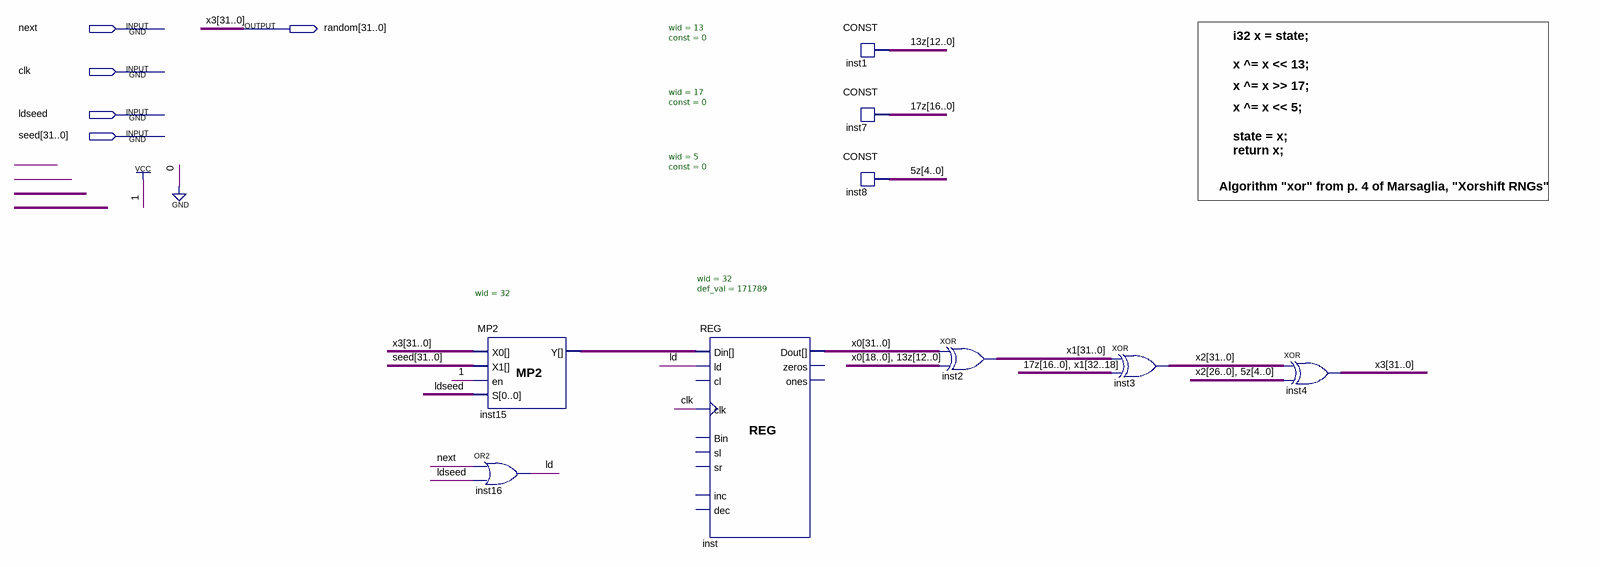
[diagram p0: schematic sheet]
// Quartus schematic random.bdf as structural Verilog: 9 symbols, 5 pins
module random (
  input  next,
  input  clk,
  input  ldseed,
  input  [31:0] seed,
  output [31:0] random
);

  wire ld;
  wire [4:0] \5z ;
  wire [12:0] \13z ;
  wire [16:0] \17z ;
  wire [31:0] inst15_y, x0, x2;
  wire [32:0] x1;

  MP2 #(.wid(32)) inst15 (.X0(random), .X1(seed), .en(1'b1), .S(ldseed), .Y(inst15_y));
  or inst16 (ld, next, ldseed);
  REG #(.wid(32), .def_val(171789)) inst (
    .ld(ld), .clk(clk), .Din(inst15_y), .Dout(x0));  // open: cl, Bin, sl, sr, inc, dec, zeros, ones
  CONST #(.wid(13), .\const (0)) inst1 (.data(\13z ));
  CONST #(.wid(17), .\const (0)) inst7 (.data(\17z ));
  CONST #(.wid(5), .\const (0)) inst8 (.data(\5z ));
  assign x1[31:0] = x0 ^ {x0[18:0], \13z };  // XOR inst2, 32 bits wide
  assign x2 = x1[31:0] ^ {\17z , x1[32:18]};  // XOR inst3, 32 bits wide
  assign random = x2 ^ {x2[26:0], \5z };  // XOR inst4, 32 bits wide

  // Other names for the same wires on the sheet: x3[31:0] = random

  // Notes on the sheet:
  //   i32 x = state;
  //   x ^= x << 13;
  //   x ^= x >> 17;
  //   x ^= x << 5;
  //   state = x;
  //   return x;
  //   Algorithm "xor" from p. 4 of Marsaglia, "Xorshift RNGs"
endmodule
